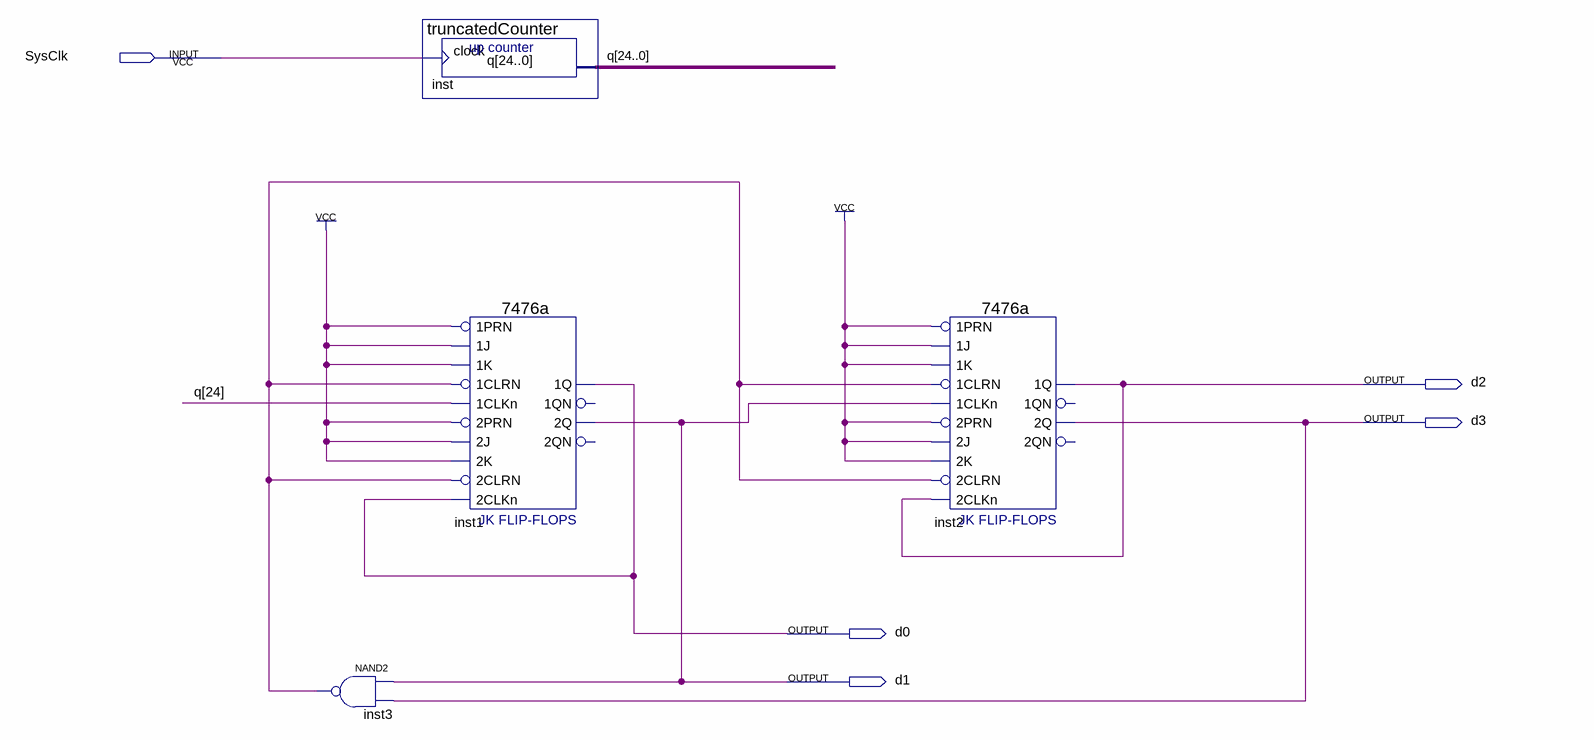
[diagram p0: schematic sheet]
// Quartus schematic Diode.bdf as structural Verilog: 4 symbols, 5 pins
module Diode (
  input  SysClk,
  output d2,
  output d3,
  output d0,
  output d1
);

  wire inst3_out;
  wire [24:0] q;

  nand inst3 (inst3_out, d1, d3);
  truncatedCounter inst (.clock(SysClk), .q(q));
  \7476a  inst1 (
    .\2CLKn (d0), .\2CLRN (inst3_out), .\1PRN (1'b1), .\1K (1'b1), .\1J (1'b1), .\1CLRN (inst3_out),
    .\1CLKn (q[24]), .\2K (1'b1), .\2J (1'b1), .\2PRN (1'b1), .\2Q (d1), .\1Q (d0));  // open: 2QN, 1QN
  \7476a  inst2 (
    .\2CLKn (d2), .\2CLRN (inst3_out), .\1PRN (1'b1), .\1K (1'b1), .\1J (1'b1), .\1CLRN (inst3_out),
    .\1CLKn (d1), .\2K (1'b1), .\2J (1'b1), .\2PRN (1'b1), .\2Q (d3), .\1Q (d2));  // open: 2QN, 1QN
endmodule
